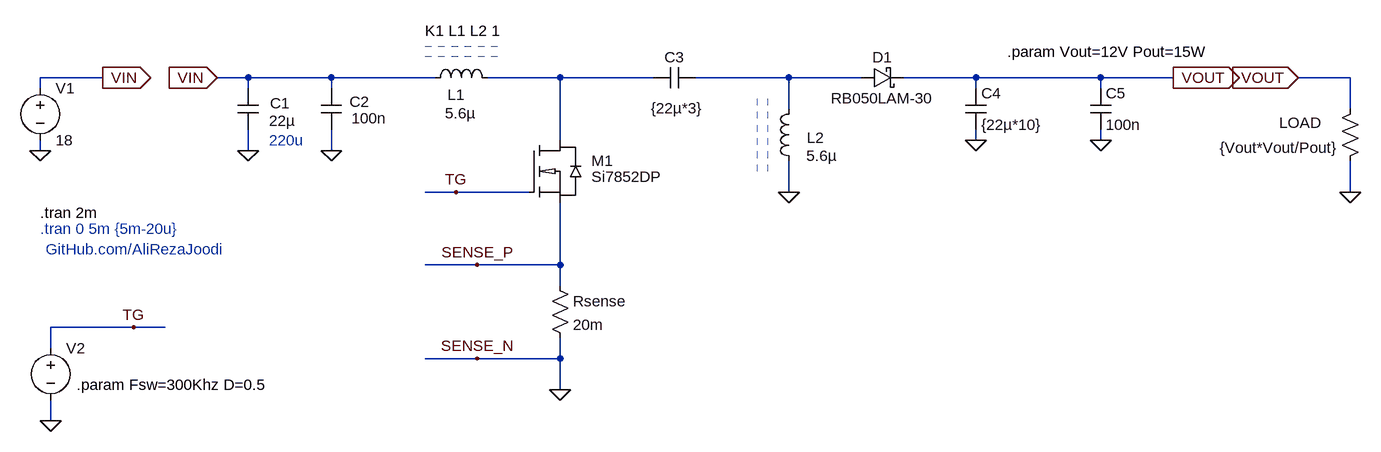
[diagram p0: schematic _PowerStage.asc]
_PowerStage.asc, the LTspice schematic file:
Version 4.1
SHEET 1 3620 1972
WIRE 1440 -400 1344 -400
WIRE 1664 -400 1616 -400
WIRE 1792 -400 1664 -400
WIRE 1952 -400 1792 -400
WIRE 2144 -400 2032 -400
WIRE 2288 -400 2144 -400
WIRE 2496 -400 2352 -400
WIRE 2608 -400 2496 -400
WIRE 2784 -400 2672 -400
WIRE 2976 -400 2784 -400
WIRE 3088 -400 2976 -400
WIRE 3360 -400 3280 -400
WIRE 1344 -384 1344 -400
WIRE 1664 -384 1664 -400
WIRE 1792 -384 1792 -400
WIRE 2784 -384 2784 -400
WIRE 2976 -384 2976 -400
WIRE 2496 -352 2496 -400
WIRE 3360 -352 3360 -400
WIRE 2144 -304 2144 -400
WIRE 2784 -304 2784 -320
WIRE 2976 -304 2976 -320
WIRE 1344 -288 1344 -304
WIRE 1664 -288 1664 -320
WIRE 1792 -288 1792 -320
WIRE 1984 -224 1936 -224
WIRE 2096 -224 1984 -224
WIRE 2496 -224 2496 -272
WIRE 3360 -224 3360 -272
WIRE 2016 -112 1936 -112
WIRE 2144 -112 2144 -208
WIRE 2144 -112 2016 -112
WIRE 2144 -80 2144 -112
WIRE 1488 -16 1360 -16
WIRE 1536 -16 1488 -16
WIRE 1360 16 1360 -16
WIRE 2016 32 1936 32
WIRE 2144 32 2144 0
WIRE 2144 32 2016 32
WIRE 2144 80 2144 32
WIRE 1360 128 1360 96
FLAG 2784 -304 0
FLAG 3360 -224 0
FLAG 1344 -288 0
FLAG 3088 -400 VOUT
IOPIN 3088 -400 Out
FLAG 1440 -400 VIN
IOPIN 1440 -400 Out
FLAG 1792 -288 0
FLAG 2976 -304 0
FLAG 2016 -112 SENSE_P
FLAG 2016 32 SENSE_N
FLAG 1984 -224 TG
FLAG 1664 -288 0
FLAG 2144 80 0
FLAG 2496 -224 0
FLAG 1616 -400 VIN
IOPIN 1616 -400 In
FLAG 3280 -400 VOUT
IOPIN 3280 -400 In
FLAG 1360 128 0
FLAG 1488 -16 TG
SYMBOL schottky 2608 -416 M90
WINDOW 0 0 32 VBottom 2
WINDOW 3 32 32 VTop 2
SYMATTR InstName D1
SYMATTR Value RB050LAM-30
SYMATTR Description Diode
SYMATTR Type diode
SYMBOL ind 1936 -384 R270
WINDOW 0 -26 48 VTop 2
WINDOW 3 -23 55 VBottom 2
SYMATTR InstName L1
SYMATTR Value 5.6µ
SYMATTR SpiceLine Rser=47m
SYMATTR Type ind
SYMBOL res 2128 -96 R0
SYMATTR InstName Rsense
SYMATTR Value 20m
SYMBOL voltage 1344 -400 R0
WINDOW 123 24 138 Left 2
WINDOW 39 24 117 Left 2
SYMATTR Value 18
SYMATTR InstName V1
SYMBOL res 3376 -368 M0
WINDOW 0 60 37 Left 2
SYMATTR InstName LOAD
SYMATTR Value {Vout*Vout/Pout}
SYMBOL cap 1776 -384 R0
WINDOW 0 44 21 Left 2
WINDOW 3 47 46 Left 2
SYMATTR InstName C2
SYMATTR Value 100n
SYMBOL cap 1648 -384 R0
WINDOW 0 50 23 Left 2
WINDOW 3 48 50 Left 2
SYMATTR InstName C1
SYMATTR Value 22µ
SYMBOL cap 2960 -384 R0
SYMATTR InstName C5
SYMATTR Value 100n
SYMBOL cap 2768 -384 R0
SYMATTR InstName C4
SYMATTR Value {22µ*10}
SYMBOL cap 2288 -384 R270
WINDOW 0 32 32 VTop 2
WINDOW 3 -15 36 VBottom 2
SYMATTR InstName C3
SYMATTR Value {22µ*3}
SYMATTR SpiceLine Rser=0.01
SYMBOL ind 2512 -256 R180
WINDOW 0 -39 52 Left 2
WINDOW 3 -11 24 Right 2
SYMATTR InstName L2
SYMATTR Value 5.6µ
SYMATTR SpiceLine Rser=47m
SYMATTR Type ind
SYMBOL voltage 1360 0 R0
WINDOW 3 41 64 Invisible 2
WINDOW 123 0 0 Left 0
SYMATTR Value PULSE(0 12 0 {0.01/Fsw} {0.01/Fsw} {D/Fsw} {1/Fsw})
SYMATTR SpiceLine Rser=10
SYMATTR InstName V2
SYMBOL MyLib\\Transistor_MOSFET_N\\MOSFET_N 2096 -304 R0
SYMATTR InstName M1
SYMATTR Value Si7852DP
TEXT 1344 -192 Left 2 !.tran 2m
TEXT 1352 -136 Left 2 ;GitHub.com/AliRezaJoodi
TEXT 1936 -472 Left 2 !K1 L1 L2 1
TEXT 1696 -304 Left 2 ;220u
TEXT 2832 -440 Left 2 !.param Vout=12V Pout=15W
TEXT 1344 -168 Left 2 ;.tran 0 5m {5m-20u}
TEXT 1400 72 Left 2 !.param Fsw=300Khz D=0.5
LINE Normal 2048 -432 1936 -432 2
LINE Normal 2048 -448 1936 -448 2
LINE Normal 2448 -256 2448 -368 2
LINE Normal 2464 -256 2464 -368 2

The netlist it stands for:
* _PowerStage.asc
D1 N002 VOUT RB050LAM-30
L1 VIN N001 5.6µ Rser=47m
Rsense SENSE_P 0 20m
V1 VIN 0 18
R§LOAD VOUT 0 {Vout*Vout/Pout}
C2 VIN 0 100n
C1 VIN 0 22µ
C5 VOUT 0 100n
C4 VOUT 0 {22µ*10}
C3 N001 N002 {22µ*3} Rser=0.01
L2 0 N002 5.6µ Rser=47m
V2 TG 0 PULSE(0 12 0 {0.01/Fsw} {0.01/Fsw} {D/Fsw} {1/Fsw}) Rser=10
M1 N001 TG SENSE_P SENSE_P Si7852DP
.model D D
.lib standard.dio
.model NMOS NMOS
.model PMOS PMOS
.lib standard.mos
.tran 2m
* GitHub.com/AliRezaJoodi
K1 L1 L2 1
* 220u
.param Vout=12V Pout=15W
* .tran 0 5m {5m-20u}
.param Fsw=300Khz D=0.5
.backanno
.end